# EAGLE schematic MLT22V1.91 (EAGLE 7.2.0)

## Sheet 1 of 5
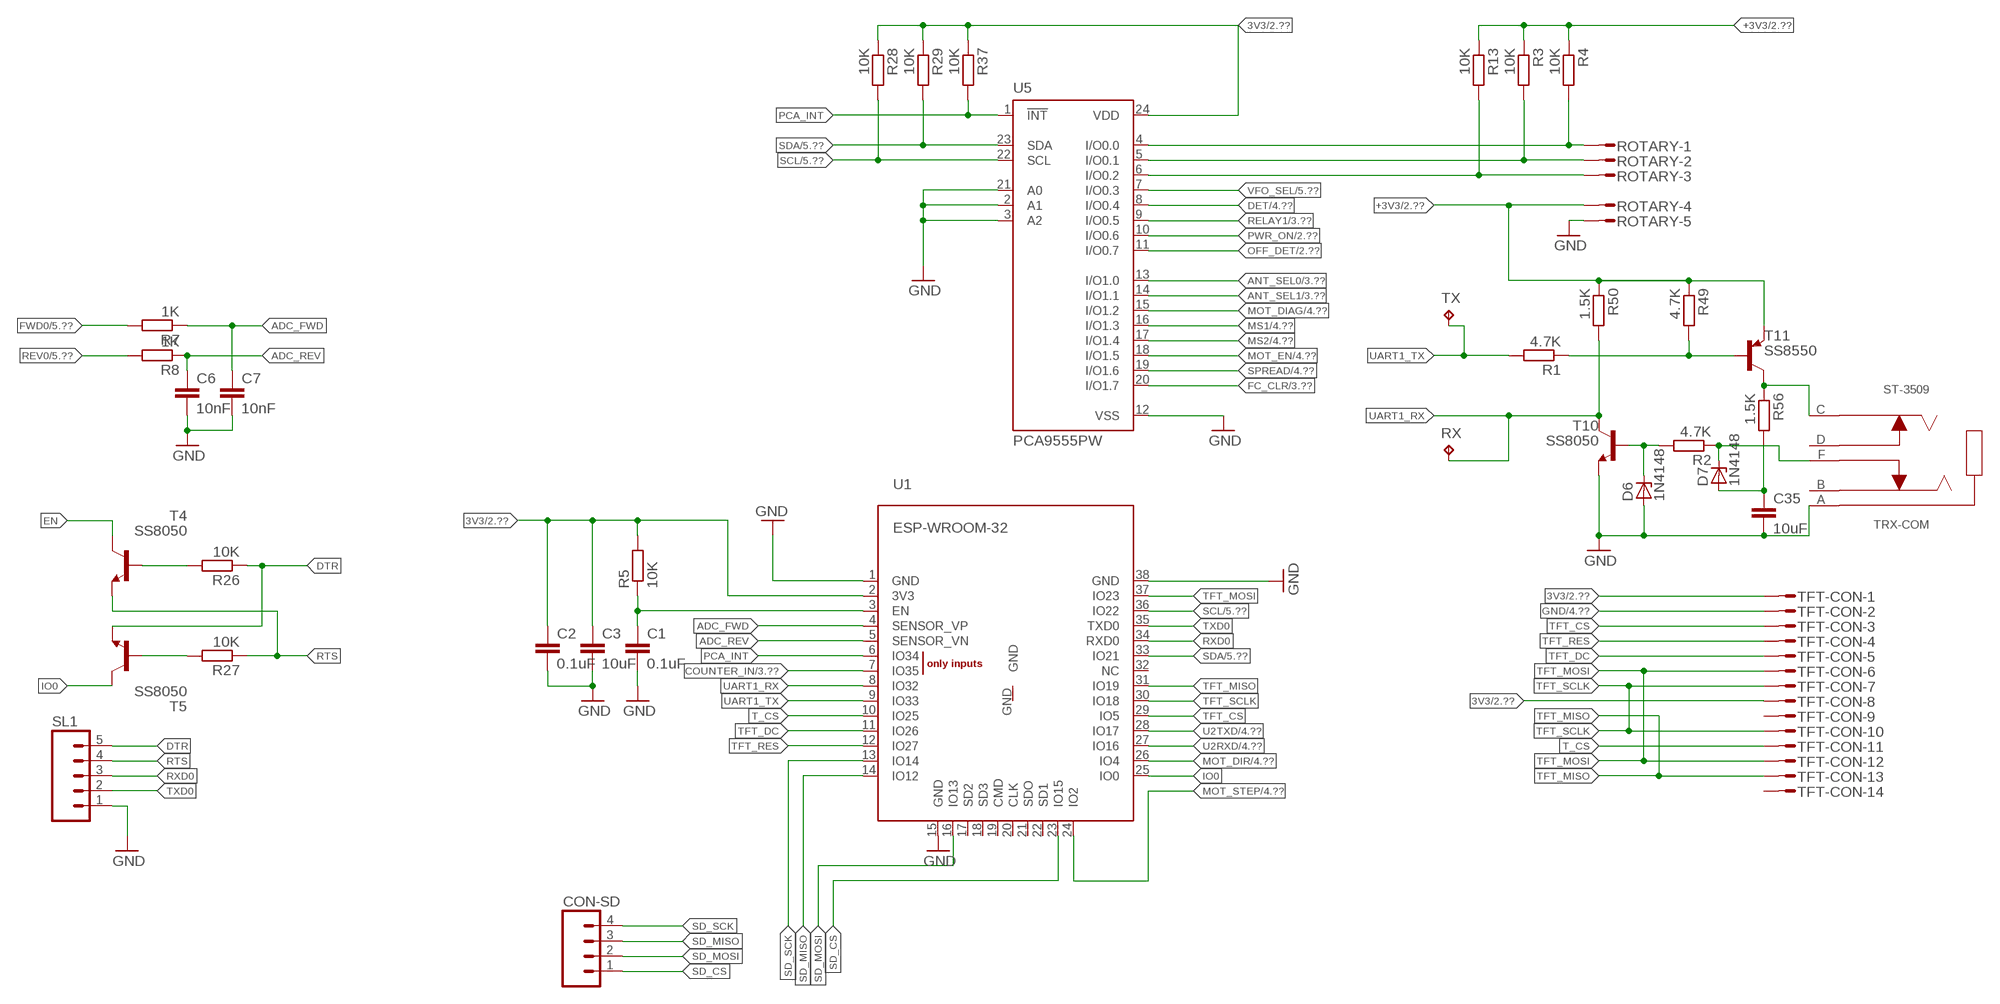
[diagram p0: schematic, sheet 1]

### Parts
C1  0.1uF  C-EUC0603  [C0603]
C2  0.1uF  C-EUC0603  [C0603]
C3  10uF  C-EUC1206  [C1206]
C6  10nF  C-EUC0603  [C0603]
C7  10nF  C-EUC0603  [C0603]
C35  10uF  C-EUC1206  [C1206]
CON-SD  M04  [04P]
D6  1N4148  ZENER-DIODESOD80C  [SOD80C]
D7  1N4148  ZENER-DIODESOD80C  [SOD80C]
R1  4.7K  R-EU_R0603  [R0603]
R2  4.7K  R-EU_R0603  [R0603]
R3  10K  R-EU_R0603  [R0603]
R4  10K  R-EU_R0603  [R0603]
R5  10K  R-EU_R0603  [R0603]
R7  1K  R-EU_R0603  [R0603]
R8  1K  R-EU_R0603  [R0603]
R13  10K  R-EU_R0603  [R0603]
R26  10K  R-EU_R0603  [R0603]
R27  10K  R-EU_R0603  [R0603]
R28  10K  R-EU_R0603  [R0603]
R29  10K  R-EU_R0603  [R0603]
R37  10K  R-EU_R0603  [R0603]
R49  4.7K  R-EU_R0603  [R0603]
R50  1.5K  R-EU_R0603  [R0603]
R56  1.5K  R-EU_R0603  [R0603]
ROTARY  S05P  [S05P]
RX  TPTP15R  [TP15R]
SL1  M05  [05P]
T4  SS8050  MMBT3904LT1-NPN-SOT23-BEC  [SOT23-BEC]
T5  SS8050  MMBT3904LT1-NPN-SOT23-BEC  [SOT23-BEC]
T10  SS8050  MMBT3904LT1-NPN-SOT23-BEC  [SOT23-BEC]
T11  SS8550  MMBT3906LT1-PNP-SOT23-BEC  [SOT23-BEC]
TFT-CON  S14P  [S14P]
TRX-COM  ST-3509  [ST-3509]
TX  TPTP15R  [TP15R]
U1  ESP-WROOM-32  [ESP-WROOM-32]
U5  PCA9555PW  [TSSOP24]

### Nets
3V3: C2.1 C3.1 R5.2 R28.1 R29.1 R37.1 TFT-CON.1 TFT-CON.8 U1.2(3V3) U5.24(VDD) ; also sheet 2,3,4,5
+3V3: R3.1 R4.1 R13.1 R49.1 R50.1 ROTARY.4 T11.E ; also sheet 2
ADC_FWD: C7.1 R7.1 U1.4(SENSOR_VP)
ADC_REV: C6.1 R8.1 U1.5(SENSOR_VN)
ANT_SEL0: U5.13(I/O1.0) ; also sheet 3
ANT_SEL1: U5.14(I/O1.1) ; also sheet 3
COUNTER_IN: U1.7(IO35) ; also sheet 3
DET: U5.8(I/O0.4) ; also sheet 4
DTR: R26.1 SL1.5 T5.E
EN: C1.1 R5.1 T4.C U1.3(EN)
ENC_SW1: R3.2 ROTARY.2 U5.5(I/O0.1)
ENC_SW2: R4.2 ROTARY.1 U5.4(I/O0.0)
FC_CLR: U5.20(I/O1.7) ; also sheet 3
FWD0: R7.2 ; also sheet 5
GND: C1.2 C2.2 C3.2 C6.2 C7.2 C35.2 D6.A ROTARY.5 SL1.1 T10.E TFT-CON.2 TRX-COM.A U1.1(GND) U1.15(GND) U1.38(GND) U5.2(A1) U5.3(A2) U5.12(VSS) U5.21(A0) ; also sheet 2,3,4,5
IO0: T5.C U1.25(IO0)
MOT_DIAG: U5.15(I/O1.2) ; also sheet 4
MOT_DIR: U1.26(IO4) ; also sheet 4
MOT_EN: U5.18(I/O1.5) ; also sheet 4
MOT_STEP: U1.24(IO2) ; also sheet 4
MS1: U5.16(I/O1.3) ; also sheet 4
MS2: U5.17(I/O1.4) ; also sheet 4
N$5: R56.1 T11.C TRX-COM.C
N$12: R13.2 ROTARY.3 U5.6(I/O0.2)
N$28: R1.1 R49.2 T11.B
N$30: D6.C R2.2 T10.B
N$31: R26.2 T4.B
N$34: R27.2 T5.B
N$38: C35.1 D7.A R56.2
N$39: D7.C R2.1 TRX-COM.F(E)
OFF_DET: U5.11(I/O0.7) ; also sheet 2
PCA_INT: R37.2 U1.6(IO34) U5.1(!INT)
PWR_ON: U5.10(I/O0.6) ; also sheet 2
RELAY1: U5.9(I/O0.5) ; also sheet 3
REV0: R8.2 ; also sheet 5
RTS: R27.1 SL1.4 T4.E
RXD0: SL1.3 U1.34(RXD0)
SCL: R28.2 U1.36(IO22) U5.22(SCL) ; also sheet 5
SD_CS: CON-SD.1 U1.23(IO15)
SD_MISO: CON-SD.3 U1.14(IO12)
SD_MOSI: CON-SD.2 U1.16(IO13)
SD_SCK: CON-SD.4 U1.13(IO14)
SDA: R29.2 U1.33(IO21) U5.23(SDA) ; also sheet 5
SPREAD: U5.19(I/O1.6) ; also sheet 4
T_CS: TFT-CON.11 U1.10(IO25)
TFT_CS: TFT-CON.3 U1.29(IO5)
TFT_DC: TFT-CON.5 U1.11(IO26)
TFT_MISO: TFT-CON.13 U1.31(IO19)
TFT_MOSI: TFT-CON.6 TFT-CON.12 U1.37(IO23)
TFT_RES: TFT-CON.4 U1.12(IO27)
TFT_SCLK: TFT-CON.7 TFT-CON.10 U1.30(IO18)
TXD0: SL1.2 U1.35(TXD0)
U2RXD: U1.27(IO16) ; also sheet 4
U2TXD: U1.28(IO17) ; also sheet 4
UART1_RX: R50.2 RX.TP T10.C U1.8(IO32)
UART1_TX: R1.2 TX.TP U1.9(IO33)
VFO_SEL: U5.7(I/O0.3) ; also sheet 5
Unconnected: TFT-CON.9 TFT-CON.14 TRX-COM.B TRX-COM.D U1.17(SD2) U1.18(SD3) U1.19(CMD) U1.20(CLK) U1.21(SDO) U1.22(SD1) U1.32(NC) U1.GND

## Sheet 2 of 5
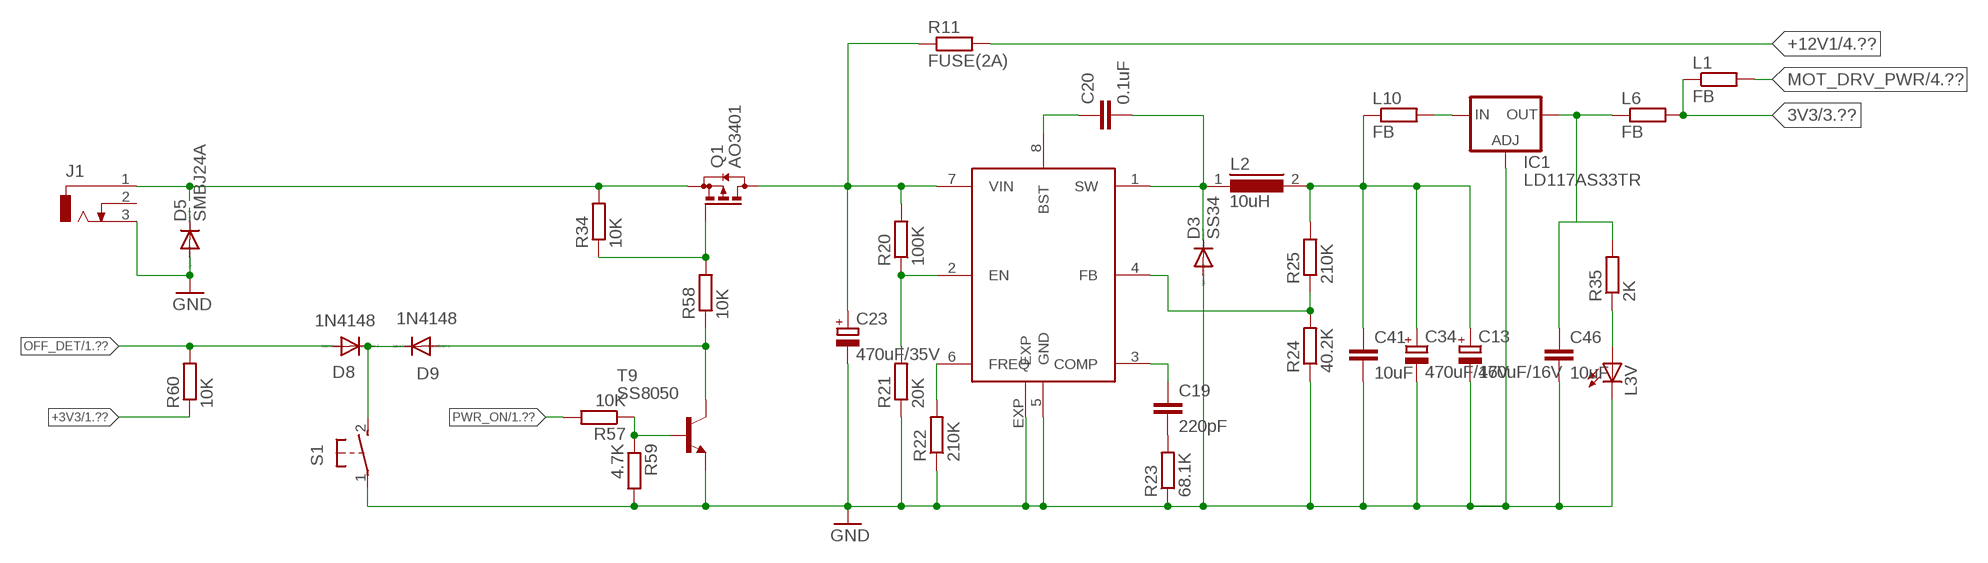
[diagram p1: schematic, sheet 2]

### Parts
C13  470uF/16V  CPOL-EU153CLV-0605  [153CLV-0605]
C19  220pF  C-EUC0603  [C0603]
C20  0.1uF  C-EUC0603  [C0603]
C23  470uF/35V  CPOL-EU175TMP-0808  [175TMP-0808]
C34  470uF/16V  CPOL-EU153CLV-0605  [153CLV-0605]
C41  10uF  C-EUC1206  [C1206]
C46  10uF  C-EUC1206  [C1206]
D3  SS34  DIODE-SMB  [SMB]
D5  SMBJ24A  DIODE-SMB  [SMB]
D8  1N4148  DIODE-SOD80C  [SOD80C]
D9  1N4148  DIODE-SOD80C  [SOD80C]
IC1  LD117AS33TR  [SOT223]
J1  DCJ0303  [DCJ0303]
L1  FB  R-EU_R1206  [R1206]
L2  10uH  DR74  [DR74]
L3V  LEDSML1206  [SML1206]
L6  FB  R-EU_R1206  [R1206]
L10  FB  R-EU_R1206  [R1206]
Q1  AO3401  BSS84  [SOT23]
R11  FUSE(2A)  R-EU_R1206  [R1206]
R20  100K  R-EU_R0603  [R0603]
R21  20K  R-EU_R0603  [R0603]
R22  210K  R-EU_R0603  [R0603]
R23  68.1K  R-EU_R0603  [R0603]
R24  40.2K  R-EU_R0603  [R0603]
R25  210K  R-EU_R0603  [R0603]
R34  10K  R-EU_R0603  [R0603]
R35  2K  R-EU_R0603  [R0603]
R57  10K  R-EU_R0603  [R0603]
R58  10K  R-EU_R0603  [R0603]
R59  4.7K  R-EU_R0603  [R0603]
R60  10K  R-EU_R0603  [R0603]
S1  31-XX  [B3F-31XX]
T9  SS8050  MMBT3904LT1-NPN-SOT23-BEC  [SOT23-BEC]
U2  MP1584  [SO-8P]

### Nets
3V3: L1.1 L6.2 ; also sheet 1,3,4,5
+3V3: C46.1 IC1.4(OUT) L6.1 R35.2 R60.1 ; also sheet 1
+5V: C13.+ C34.+ C41.1 L2.2 L10.1 R25.2 ; also sheet 3,5
+12V1: R11.2 ; also sheet 4
DCDC_BST2: C20.1 U2.8(BST)
DCDC_COMP2: C19.1 U2.3(COMP)
DCDC_EN2: R20.1 R21.2 U2.2(EN)
DCDC_FB2: R24.2 R25.1 U2.4(FB)
DCDC_SW2: C20.2 D3.C L2.1 U2.1(SW)
GND: C13.- C23.- C34.- C41.2 C46.2 D3.A D5.A IC1.1(ADJ) J1.3 L3V.C R21.1 R22.1 R23.1 R24.1 R59.2 S1.1(P) T9.E U2.5(GND) U2.EXP ; also sheet 1,3,4,5
MOT_DRV_PWR: L1.2 ; also sheet 4
N$2: L3V.A R35.1
N$3: D5.C J1.1 Q1.2(S) R34.2
N$17: C19.2 R23.2
N$26: IC1.3(IN) L10.2
N$29: R22.2 U2.6(FREQ)
N$42: Q1.1(G) R34.1 R58.2
N$43: R57.1 R59.1 T9.B
N$45: D8.C D9.C S1.2(S)
N$55: C23.+ Q1.3(D) R11.1 R20.2 U2.7(VIN)
OFF_DET: D8.A R60.2 ; also sheet 1
ONOFF: D9.A R58.1 T9.C
PWR_ON: R57.2 ; also sheet 1
Unconnected: J1.2

## Sheet 3 of 5
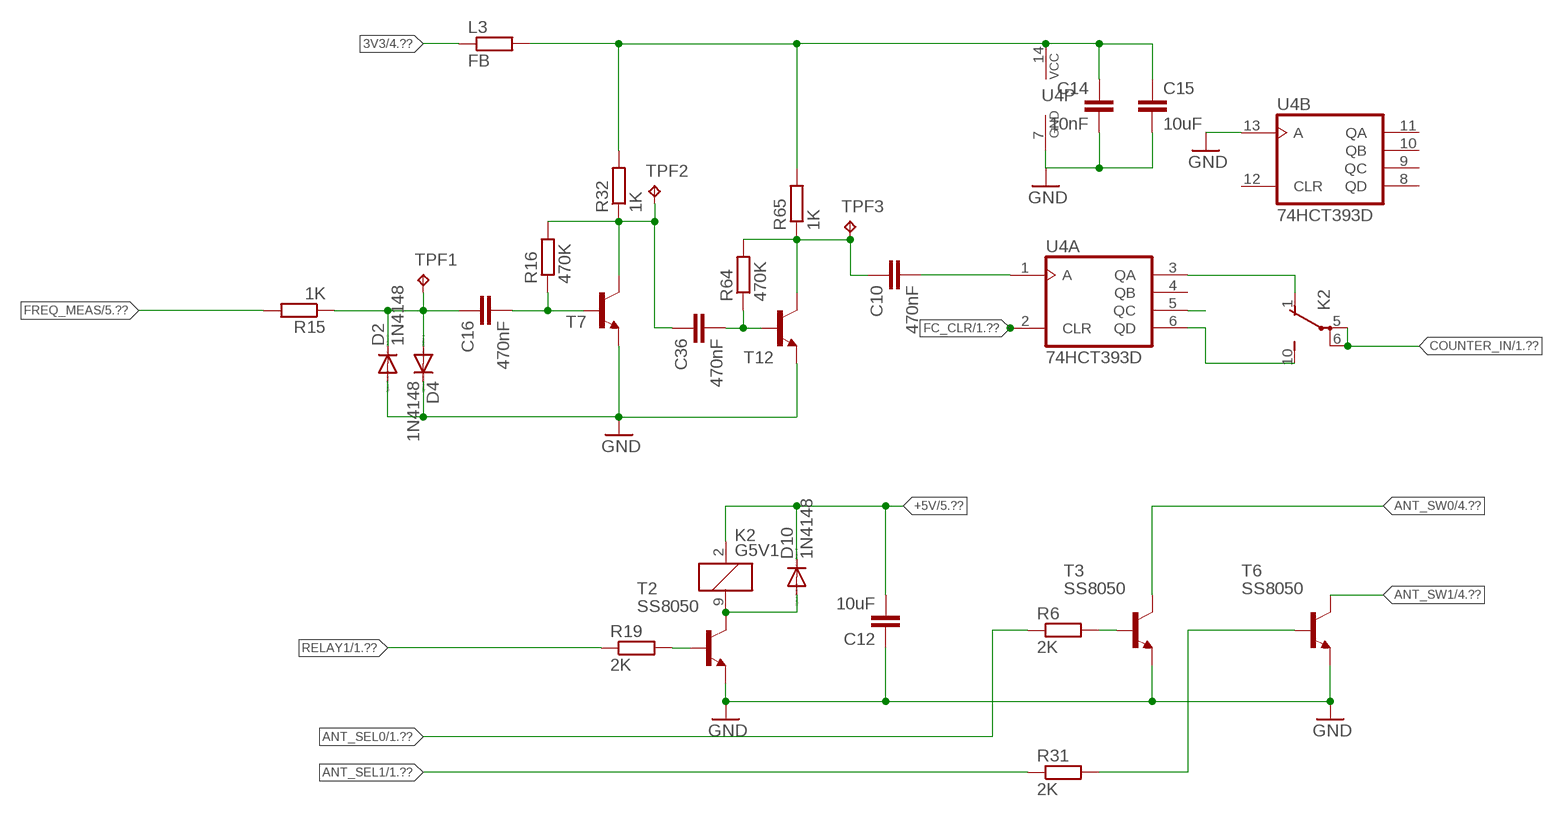
[diagram p2: schematic, sheet 3]

### Parts
C10  470nF  C-EUC0603  [C0603]
C12  10uF  C-EUC1206  [C1206]
C14  10nF  C-EUC0603  [C0603]
C15  10uF  C-EUC1206  [C1206]
C16  470nF  C-EUC0603  [C0603]
C36  470nF  C-EUC0603  [C0603]
D2  1N4148  DIODE-SOD80C  [SOD80C]
D4  1N4148  DIODE-SOD80C  [SOD80C]
D10  1N4148  DIODE-SOD80C  [SOD80C]
K2  G5V1  [G5V1]
L3  FB  R-EU_R1206  [R1206]
R6  2K  R-EU_R0603  [R0603]
R15  1K  R-EU_R0603  [R0603]
R16  470K  R-EU_R0603  [R0603]
R19  2K  R-EU_R0603  [R0603]
R31  2K  R-EU_R0603  [R0603]
R32  1K  R-EU_R0603  [R0603]
R64  470K  R-EU_R0603  [R0603]
R65  1K  R-EU_R0603  [R0603]
T2  SS8050  MMBT3904LT1-NPN-SOT23-BEC  [SOT23-BEC]
T3  SS8050  MMBT3904LT1-NPN-SOT23-BEC  [SOT23-BEC]
T6  SS8050  MMBT3904LT1-NPN-SOT23-BEC  [SOT23-BEC]
T7  MMBT3904LT1-NPN-SOT23-BEC  [SOT23-BEC]
T12  MMBT3904LT1-NPN-SOT23-BEC  [SOT23-BEC]
TPF1  TPTP15R  [TP15R]
TPF2  TPTP15R  [TP15R]
TPF3  TPTP15R  [TP15R]
U4  74HCT393D  [SO14]

### Nets
3V3: L3.1 ; also sheet 1,2,4,5
3V3_F: C14.1 C15.1 L3.2 R32.2 R65.2 U4.14(P:VCC) ; also sheet 5
+5V: C12.2 D10.C K2.2 ; also sheet 2,5
ANT_SEL0: R6.1 ; also sheet 1
ANT_SEL1: R31.1 ; also sheet 1
ANT_SW0: T3.C ; also sheet 4
ANT_SW1: T6.C ; also sheet 4
COUNTER_IN: K2.5(2:P) K2.6(2:P) ; also sheet 1
FC_CLR: U4.2(A:CLR) ; also sheet 1
FREQ_BY_16: K2.10(2:S) U4.6(A:QD)
FREQ_MEAS: R15.2 ; also sheet 5
FREQIN0: C36.1 R16.2 R32.1 T7.C TPF2.TP
FREQIN1: C10.1 R64.2 R65.1 T12.C TPF3.TP
GND: C12.1 C14.2 C15.2 D2.A D4.C T2.E T3.E T6.E T7.E T12.E U4.7(P:GND) U4.13(B:A) ; also sheet 1,2,4,5
N$1: C10.2 U4.1(A:A)
N$6: K2.1(2:O) U4.3(A:QA)
N$9: U4.5(A:QC)
N$10: R6.2 T3.B
N$16: C16.1 D2.C D4.A R15.1 TPF1.TP
N$21: D10.A K2.9 T2.C
N$24: R19.2 T2.B
N$35: R31.2 T6.B
N$36: C16.2 R16.1 T7.B
N$49: C36.2 R64.1 T12.B
RELAY1: R19.1 ; also sheet 1
Unconnected: U4.4(A:QB) U4.8(B:QD) U4.9(B:QC) U4.10(B:QB) U4.11(B:QA) U4.12(B:CLR)

## Sheet 4 of 5
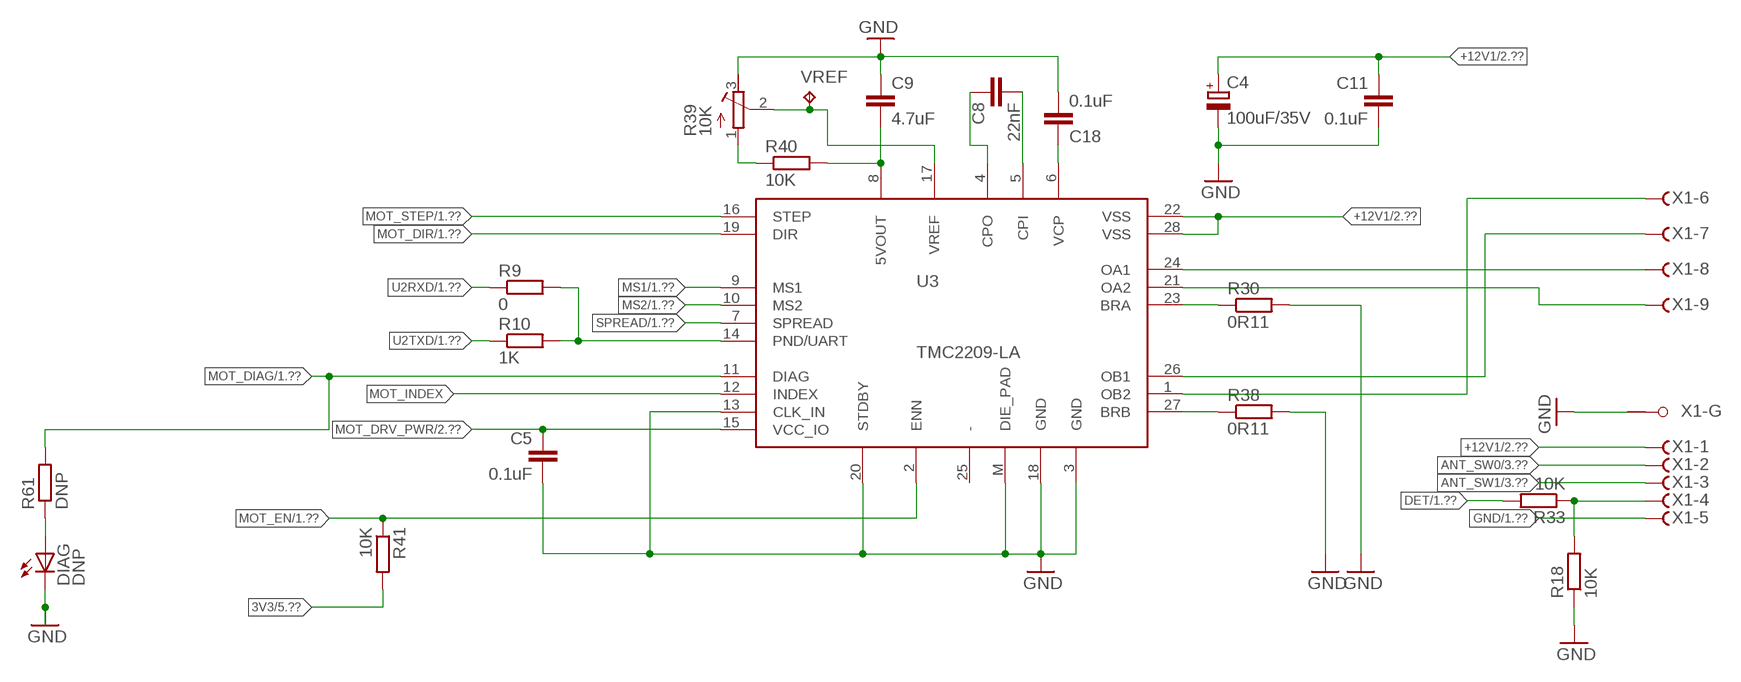
[diagram p3: schematic, sheet 4]

### Parts
C4  100uF/35V  CPOL-EU150CLZ-1010  [150CLZ-1010]
C5  0.1uF  C-EUC0603  [C0603]
C8  22nF  C-EUC0603  [C0603]
C9  4.7uF  C-EUC1206  [C1206]
C11  0.1uF  C-EUC0603  [C0603]
C18  0.1uF  C-EUC0603  [C0603]
DIAG  DNP  LEDSML1206  [SML1206]
R9  0  R-EU_R0603  [R0603]
R10  1K  R-EU_R0603  [R0603]
R18  10K  R-EU_R0603  [R0603]
R30  0R11  R-EU_R1206  [R1206]
R33  10K  R-EU_R0603  [R0603]
R38  0R11  R-EU_R1206  [R1206]
R39  10K  R-TRIMM3103  [RTRIM3103]
R40  10K  R-EU_R0603  [R0603]
R41  10K  R-EU_R0603  [R0603]
R61  DNP  R-EU_R0603  [R0603]
U3  TMC2209-LA  [QFN28]
VREF  TPB1,27  [B1,27]
X1  F09HPS  [F09HP]

### Nets
3V3: R41.2 ; also sheet 1,2,3,5
5VOUT: C9.2 R40.2 U3.8(5VOUT)
+12V1: C4.+ C11.1 U3.22(VSS) U3.28(VSS) X1.1(-1:F) ; also sheet 2
ANT_SW0: X1.2(-2:F) ; also sheet 3
ANT_SW1: X1.3(-3:F) ; also sheet 3
BRA: R30.1 U3.23(BRA)
BRB: R38.1 U3.27(BRB)
CPI: C8.2 U3.5(CPI)
CPO: C8.1 U3.4(CPO)
DET: R33.2 ; also sheet 1
GND: C4.- C5.2 C9.1 C11.2 C18.2 DIAG.C R18.1 R30.2 R38.2 R39.3(E) U3.3(GND) U3.13(CLK_IN) U3.18(GND) U3.20(STDBY) U3.M(DIE_PAD) X1.5(-5:F) X1.G1(-G:G1) ; also sheet 1,2,3,5
MOT_DIAG: R61.2 U3.11(DIAG) ; also sheet 1
MOT_DIR: U3.19(DIR) ; also sheet 1
MOT_DRV_PWR: C5.1 U3.15(VCC_IO) ; also sheet 2
MOT_EN: R41.1 U3.2(ENN) ; also sheet 1
MOT_INDEX: U3.12(INDEX)
MOT_STEP: U3.16(STEP) ; also sheet 1
MS1: U3.9(MS1) ; also sheet 1
MS2: U3.10(MS2) ; also sheet 1
N$40: DIAG.A R61.1
N$41: R39.1(A) R40.1
N$51: R18.2 R33.1 X1.4(-4:F)
OA1: U3.24(OA1) X1.8(-8:F)
OA2: U3.21(OA2) X1.9(-9:F)
OB1: U3.26(OB1) X1.7(-7:F)
OB2: U3.1(OB2) X1.6(-6:F)
PD/UART: R9.2 R10.2 U3.14(PND/UART)
SPREAD: U3.7(SPREAD) ; also sheet 1
U2RXD: R9.1 ; also sheet 1
U2TXD: R10.1 ; also sheet 1
VCP: C18.1 U3.6(VCP)
VREF: R39.2(S) U3.17(VREF) VREF.TP
Unconnected: U3.25(-) X1.G2(-G:G2)

## Sheet 5 of 5
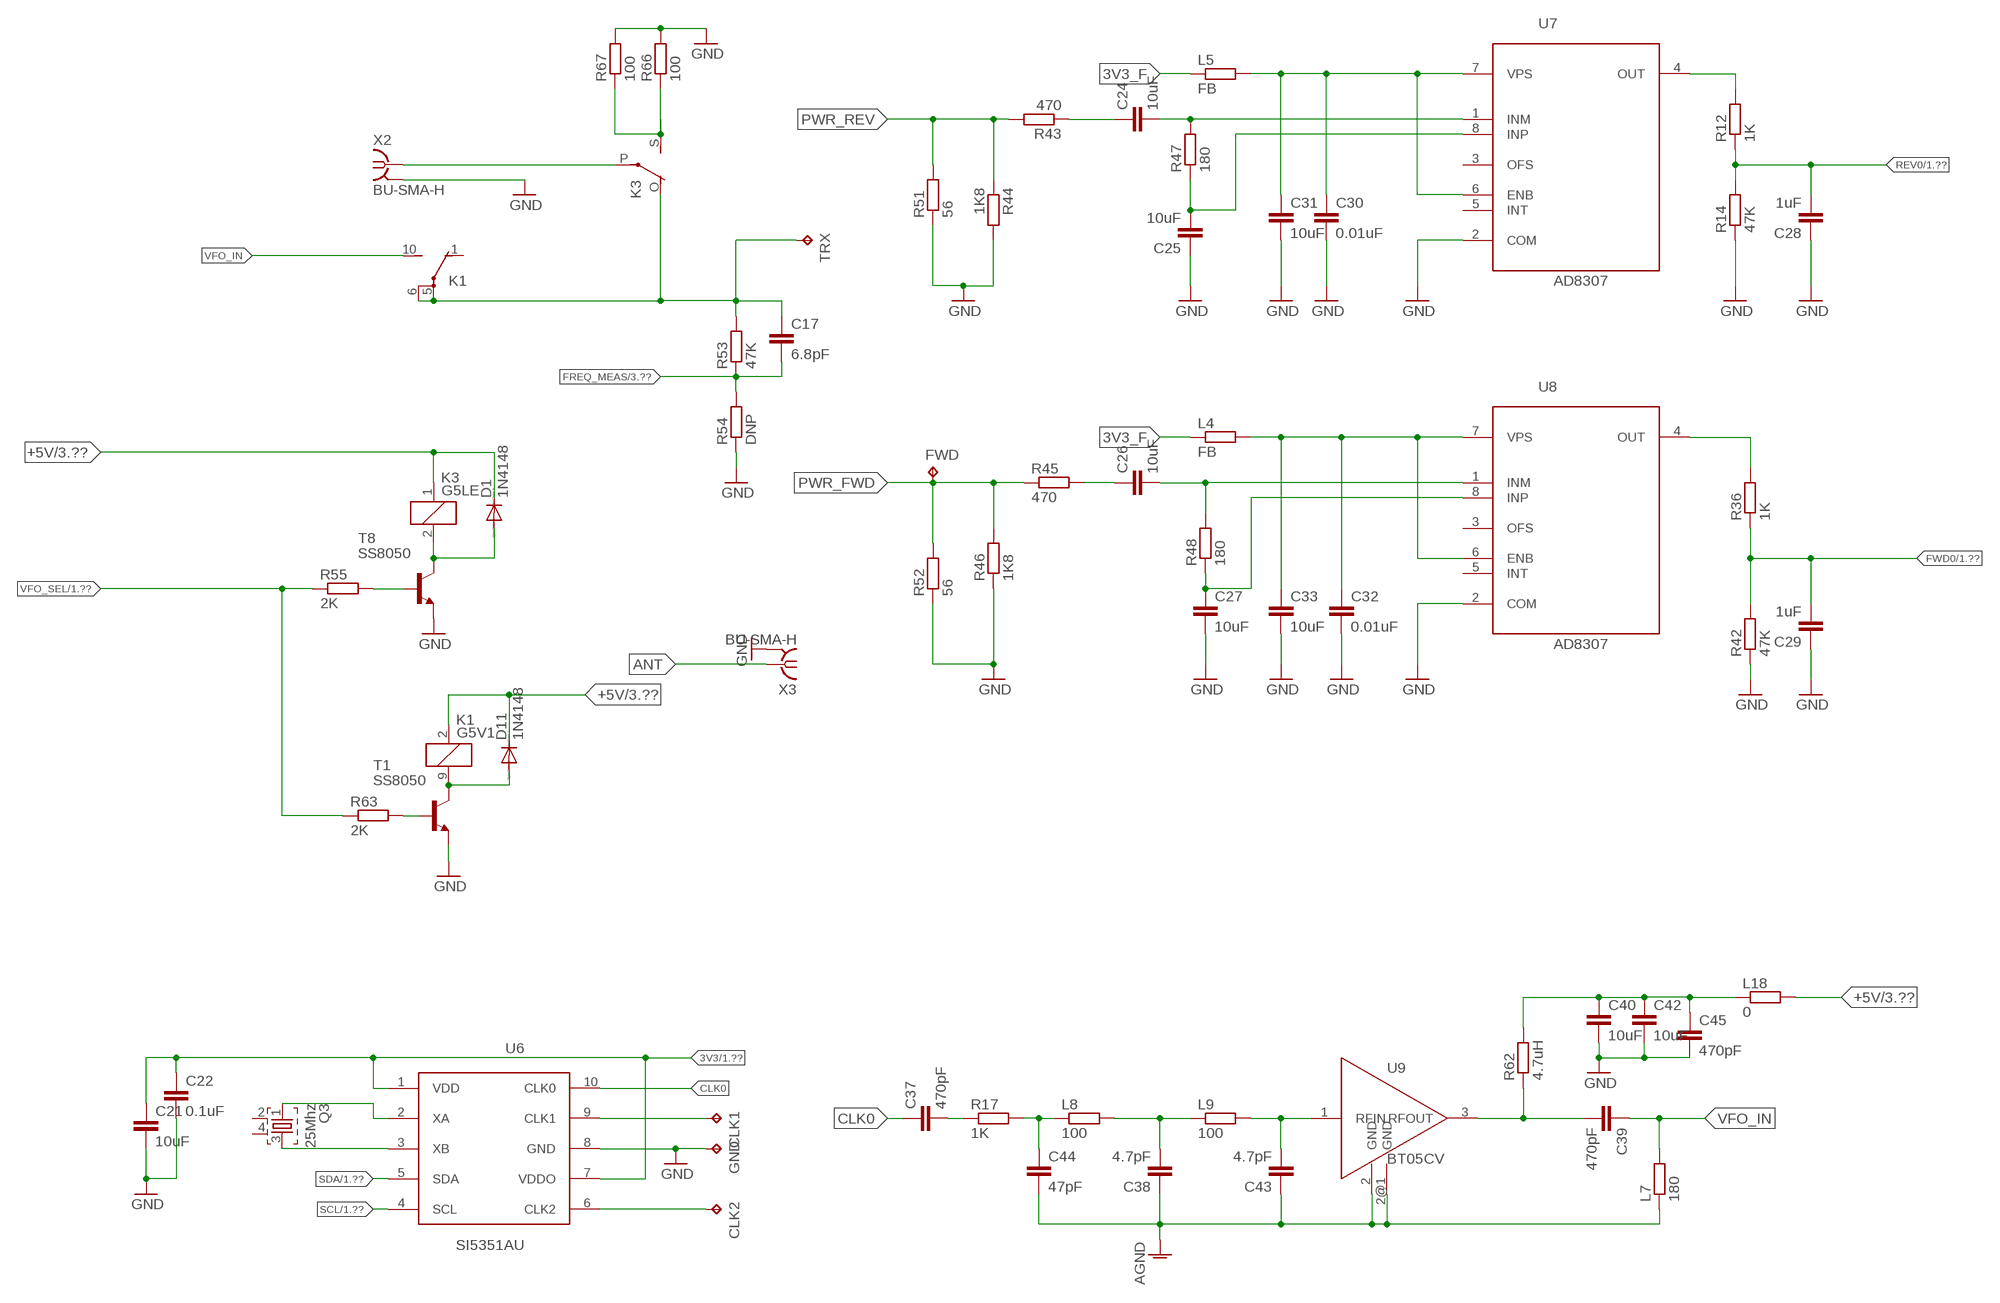
[diagram p4: schematic, sheet 5]

### Parts
C17  6.8pF  C-EUC0603  [C0603]
C21  10uF  C-EUC1206  [C1206]
C22  0.1uF  C-EUC0603  [C0603]
C24  10uF  C-EUC1206  [C1206]
C25  10uF  C-EUC1206  [C1206]
C26  10uF  C-EUC1206  [C1206]
C27  10uF  C-EUC1206  [C1206]
C28  1uF  C-EUC0603  [C0603]
C29  1uF  C-EUC0603  [C0603]
C30  0.01uF  C-EUC0603  [C0603]
C31  10uF  C-EUC1206  [C1206]
C32  0.01uF  C-EUC0603  [C0603]
C33  10uF  C-EUC1206  [C1206]
C37  470pF  C-EUC0603  [C0603]
C38  4.7pF  C-EUC0603  [C0603]
C39  470pF  C-EUC0805  [C0805]
C40  10uF  C-EUC1206  [C1206]
C42  10uF  C-EUC1206  [C1206]
C43  4.7pF  C-EUC0603  [C0603]
C44  47pF  C-EUC0603  [C0603]
C45  470pF  C-EUC0603  [C0603]
CLK1  TPTP15R  [TP15R]
CLK2  TPTP15R  [TP15R]
D1  1N4148  DIODE-SOD80C  [SOD80C]
D11  1N4148  DIODE-SOD80C  [SOD80C]
FWD  TPPAD1-20  [P1-20]
GND  TPTP15R  [TP15R]
K1  G5V1  [G5V1]
K3  G5LE  [G5LE]
L4  FB  R-EU_R1206  [R1206]
L5  FB  R-EU_R1206  [R1206]
L7  180  R-EU_R0603  [R0603]
L8  100  R-EU_R0603  [R0603]
L9  100  R-EU_R0603  [R0603]
L18  0  R-EU_R1206  [R1206]
Q3  25Mhz  CRYSTALSMD3025  [SMD3225]
R12  1K  R-EU_R0603  [R0603]
R14  47K  R-EU_R0603  [R0603]
R17  1K  R-EU_R0603  [R0603]
R36  1K  R-EU_R0603  [R0603]
R42  47K  R-EU_R0603  [R0603]
R43  470  R-EU_R1206  [R1206]
R44  1K8  R-EU_R1206  [R1206]
R45  470  R-EU_R1206  [R1206]
R46  1K8  R-EU_R1206  [R1206]
R47  180  R-EU_R0603  [R0603]
R48  180  R-EU_R0603  [R0603]
R51  56  R-EU_0922/22  [0922/22]
R52  56  R-EU_0922/22  [0922/22]
R53  47K  R-EU_R0603  [R0603]
R54  DNP  R-EU_R0603  [R0603]
R55  2K  R-EU_R0603  [R0603]
R62  4.7uH  R-EU_R0805  [R0805]
R63  2K  R-EU_R0603  [R0603]
R66  100  R-EU_0922/22  [0922/22]
R67  100  R-EU_0922/22  [0922/22]
T1  SS8050  MMBT3904LT1-NPN-SOT23-BEC  [SOT23-BEC]
T8  SS8050  MMBT3904LT1-NPN-SOT23-BEC  [SOT23-BEC]
TRX  TPPAD1-20  [P1-20]
U6  SI5351AU  [MSOP10]
U7  AD8307  [SO08]
U8  AD8307  [SO08]
U9  BT05CV  [SOT89]
X2  BU-SMA-H  [BU-SMA-H]
X3  BU-SMA-H  [BU-SMA-H]

### Nets
3V3: C21.1 C22.1 U6.1(VDD) U6.7(VDDO) ; also sheet 1,2,3,4
3V3_F: L4.1 L5.1 ; also sheet 3
+5V: D1.C D11.C K1.2 K3.1 L18.2 ; also sheet 2,3
ANT: X3.1
CLK0: C37.1 U6.10(CLK0)
CLK1: CLK1.TP U6.9(CLK1)
CLK2: CLK2.TP U6.6(CLK2)
FREQ_MEAS: C17.2 R53.1 R54.2 ; also sheet 3
FWD0: C29.2 R36.1 R42.2 ; also sheet 1
GND: C21.2 C22.2 C25.1 C27.2 C28.1 C29.1 C30.2 C31.2 C32.2 C33.2 C38.1 C40.2 C42.2 C43.1 C44.2 C45.2 GND.TP L7.1 R14.1 R42.1 R44.2 R46.1 R51.1 R52.1 R54.1 R66.2 R67.2 T1.E T8.E U6.8(GND) U7.2(COM) U8.2(COM) U9.2(GND) U9.2@1(GND) X2.2 X2.3 X2.4 X2.5 X3.2 X3.3 X3.4 X3.5 ; supply symbol labelled AGND ; also sheet 1,2,3,4
N$4: C24.2 R47.2 U7.1(INM)
N$7: C25.2 R47.1 U7.8(INP)
N$8: C24.1 R43.1
N$11: C30.1 C31.1 L5.2 U7.6(ENB) U7.7(VPS)
N$13: R12.2 U7.4(OUT)
N$14: R55.2 T8.B
N$15: C32.1 C33.1 L4.2 U8.6(ENB) U8.7(VPS)
N$18: D1.A K3.2 T8.C
N$19: K3.S(2:S) R66.1 R67.1
N$20: C27.1 R48.1 U8.8(INP)
N$22: C26.2 R48.2 U8.1(INM)
N$23: C26.1 R45.2
N$25: R36.2 U8.4(OUT)
N$27: Q3.1 U6.2(XA)
N$32: Q3.3 U6.3(XB)
N$33: C38.2 L8.2 L9.1
N$37: C43.2 L9.2 U9.1(RFIN)
N$44: C39.2 R62.1 U9.3(RFOUT)
N$46: D11.A K1.9 T1.C
N$47: R63.2 T1.B
N$48: C37.2 R17.1
N$50: C44.1 L8.1 R17.2
PA3V: C40.1 C42.1 C45.1 L18.1 R62.2
PWR_FWD: FWD.TP R45.1 R46.2 R52.2
PWR_REV: R43.2 R44.1 R51.2
REV0: C28.2 R12.1 R14.2 ; also sheet 1
SCL: U6.4(SCL) ; also sheet 1
SDA: U6.5(SDA) ; also sheet 1
TRX: C17.1 K1.5(2:P) K1.6(2:P) K3.O(2:O) R53.2 TRX.TP
TRX_IN: K3.P(2:P) X2.1
VFO_IN: C39.1 K1.10(2:S) L7.2
VFO_SEL: R55.1 R63.1 ; also sheet 1
Unconnected: K1.1(2:O) Q3.2 Q3.4 U7.3(OFS) U7.5(INT) U8.3(OFS) U8.5(INT)

## Library data of the parts
C1-C3 C5-C12 C14-C22 C24-C33 C35-C46 = rcl:C-EU: CAPACITOR, European symbol
C4 C13 C23 C34 = rcl:CPOL-EU: POLARIZED CAPACITOR, European symbol
CLK1 CLK2 FWD GND RX TPF1-TPF3 TRX TX VREF = testpad:TP: Test pad
CON-SD = con-amp-quick:M04: AMP QUICK CONNECTOR; OC_FARNELL: unknown; OC_NEWARK: unknown
D1-D5 D8-D11 = diode:DIODE-: DIODE
D6 D7 = diode:ZENER-DIODE: Z-Diode
DIAG L3V = led:LED: LED OSRAM: - CHIPLED LG R971, LG N971, LY N971, LG Q971, LY Q971, LO R971, LY R971 LH N974, LH R974 LS Q976, LO Q976, LY Q976 LO Q996 - Hyper CHIPLED LW Q18S LB Q993, LB Q99A, LB R99A - SideLED LS A670, LO A670, LY A670, LG A670, LP A670 LB A673, LV A673, LT A673, LW A673 LH A674 LY A675 LS A676, LA A676, LO A676, LY A676, LW A676 LS A679, LY A679, LG A679 - Hyper Micro SIDELED® LS Y876, LA Y876, LO Y876, LY Y876 LT Y87S - SmartLED LW L88C, LW L88S LB L89C, LB L89S, LG L890 LS L89K, LO L89K, LY L89K LS L896, LA L896, LO L896, LY L896 - TOPLED LS T670, LO T670, LY T670, LG T670, LP T670 LSG T670, LSP T670, LSY T670, LOP T670, LYG T670 LG T671, LOG T671, LSG T671 LB T673, LV T673, LT T673, LW T673 LH T674 LS T676, LA T676, LO T676, LY T676, LB T676, LH T676, LSB T676, LW T676 LB T67C, LV T67C, LT T67C, LS T67K, LO T67K, LY T67K, LW E67C LS E67B, LA E67B, LO E67B, LY E67B, LB E67C, LV E67C, LT E67C LW T67C LS T679, LY T679, LG T679 LS T770, LO T770, LY T770, LG T770, LP T770 LB T773, LV T773, LT T773, LW T773 LH T774 LS E675, LA E675, LY E675, LS T675 LS T776, LA T776, LO T776, LY T776, LB T776 LHGB T686 LT T68C, LB T68C - Hyper Mini TOPLED® LB M676 - Mini TOPLED Santana® LG M470 LS M47K, LO M47K, LY M47K Source: http://www.osram.convergy.de LUXEON: - LUMILED® LXK2-PW12-R00, LXK2-PW12-S00, LXK2-PW14-U00, LXK2-PW14-V00 LXK2-PM12-R00, LXK2-PM12-S00, LXK2-PM14-U00 LXK2-PE12-Q00, LXK2-PE12-R00, LXK2-PE12-S00, LXK2-PE14-T00, LXK2-PE14-U00 LXK2-PB12-K00, LXK2-PB12-L00, LXK2-PB12-M00, LXK2-PB14-N00, LXK2-PB14-P00, LXK2-PB14-Q00 LXK2-PR12-L00, LXK2-PR12-M00, LXK2-PR14-Q00, LXK2-PR14-R00 LXK2-PD12-Q00, LXK2-PD12-R00, LXK2-PD12-S00 LXK2-PH12-R00, LXK2-PH12-S00 LXK2-PL12-P00, LXK2-PL12-Q00, LXK2-PL12-R00 Source: www.luxeon.com KINGBRIGHT: KA-3528ASYC Source: www.kingbright.com
IC1 = v-reg:LD117A?*: Low drop fixed and adjustable positive voltage regulators 1 A Source: http://www.st.com/stonline/products/literature/ds/7194/ld1117axx.pdf
J1 = con-jack:DCJ0303: DC POWER JACK Source: DCJ0303.pdf; OC_FARNELL: unknown; OC_NEWARK: unknown
K1 K2 = relay:G5V1: RELAY 1 x switch, 0.5 A/125 V AC, 1 A/24 V DC , Omron; MPN: G5V-1-DC24; OC_FARNELL: 9949593; OC_NEWARK: 36M6377
K3 = relay:G5LE: RELAY 1 x switch, 10 A/120 V AC, 8 A/30 V DC, Omron; OC_FARNELL: unknown; OC_NEWARK: unknown
L1 L3-L10 L18 R1-R38 R40-R67 = rcl:R-EU_: RESISTOR, European symbol
L2 = inductors:DR74: High Power Density, High Efficiency, Shielded Inductors Source: coiltronics_dr_series.pdf
Q1 = transistor-small-signal:BSS84: P-CHANNEL MOS FET
Q3 = Si5351:CRYSTALSMD
R39 = rcl:R-TRIMM: Trimm resistor
ROTARY = con-amp-mt:S05P: AMP MT CONNECTOR; OC_FARNELL: unknown; OC_NEWARK: unknown
S1 = switch-omron:31-XX: OMRON SWITCH; MPN: B3F-3100; OC_FARNELL: 959704; OC_NEWARK: 36M3582
SL1 = con-amp-quick:M05: AMP QUICK CONNECTOR; OC_FARNELL: unknown; OC_NEWARK: unknown
T1-T3 T6 T8 T9 = transistor-neu-to92:*-NPN-: NPN Transistror BF959 corrected 2008.03.06
T4 T5 T7 T10 T12 = transistor:*-NPN-: NPN Transistror BF959 corrected 2008.03.06
T11 = transistor:*-PNP-: PNP Transistror
TFT-CON = con-amp-mt:S14P: AMP MT CONNECTOR; OC_FARNELL: unknown; OC_NEWARK: unknown
TRX-COM = _RoweTel:ST-3509
U1 = esp32:ESP-WROOM-32
U2 = PAM2421:MP1584
U3 = MotorDriver:TMC2209-LA
U4 = 74xx-eu:74*393: Dual 4-bit decade and binary COUNTER
U5 = micro-philips:PCA9555: 16-bit I2C and SMBus I/O port with interrupt Source: PCA9555_5.pdf; MPN: PCA9555PW; OC_FARNELL: 1408297; OC_NEWARK: 63K6069
U6 = Si5351:SI5351A
U7 U8 = _RoweTel:AD8307
U9 = Si5351:BT05CV
X1 = con-subd:F09HPS: SUB-D; OC_FARNELL: unknown; OC_NEWARK: unknown
X2 X3 = con-coax:BU-SMA-H: FEMALE SMA CONNECTOR Radiall; OC_FARNELL: unknown; OC_NEWARK: unknown